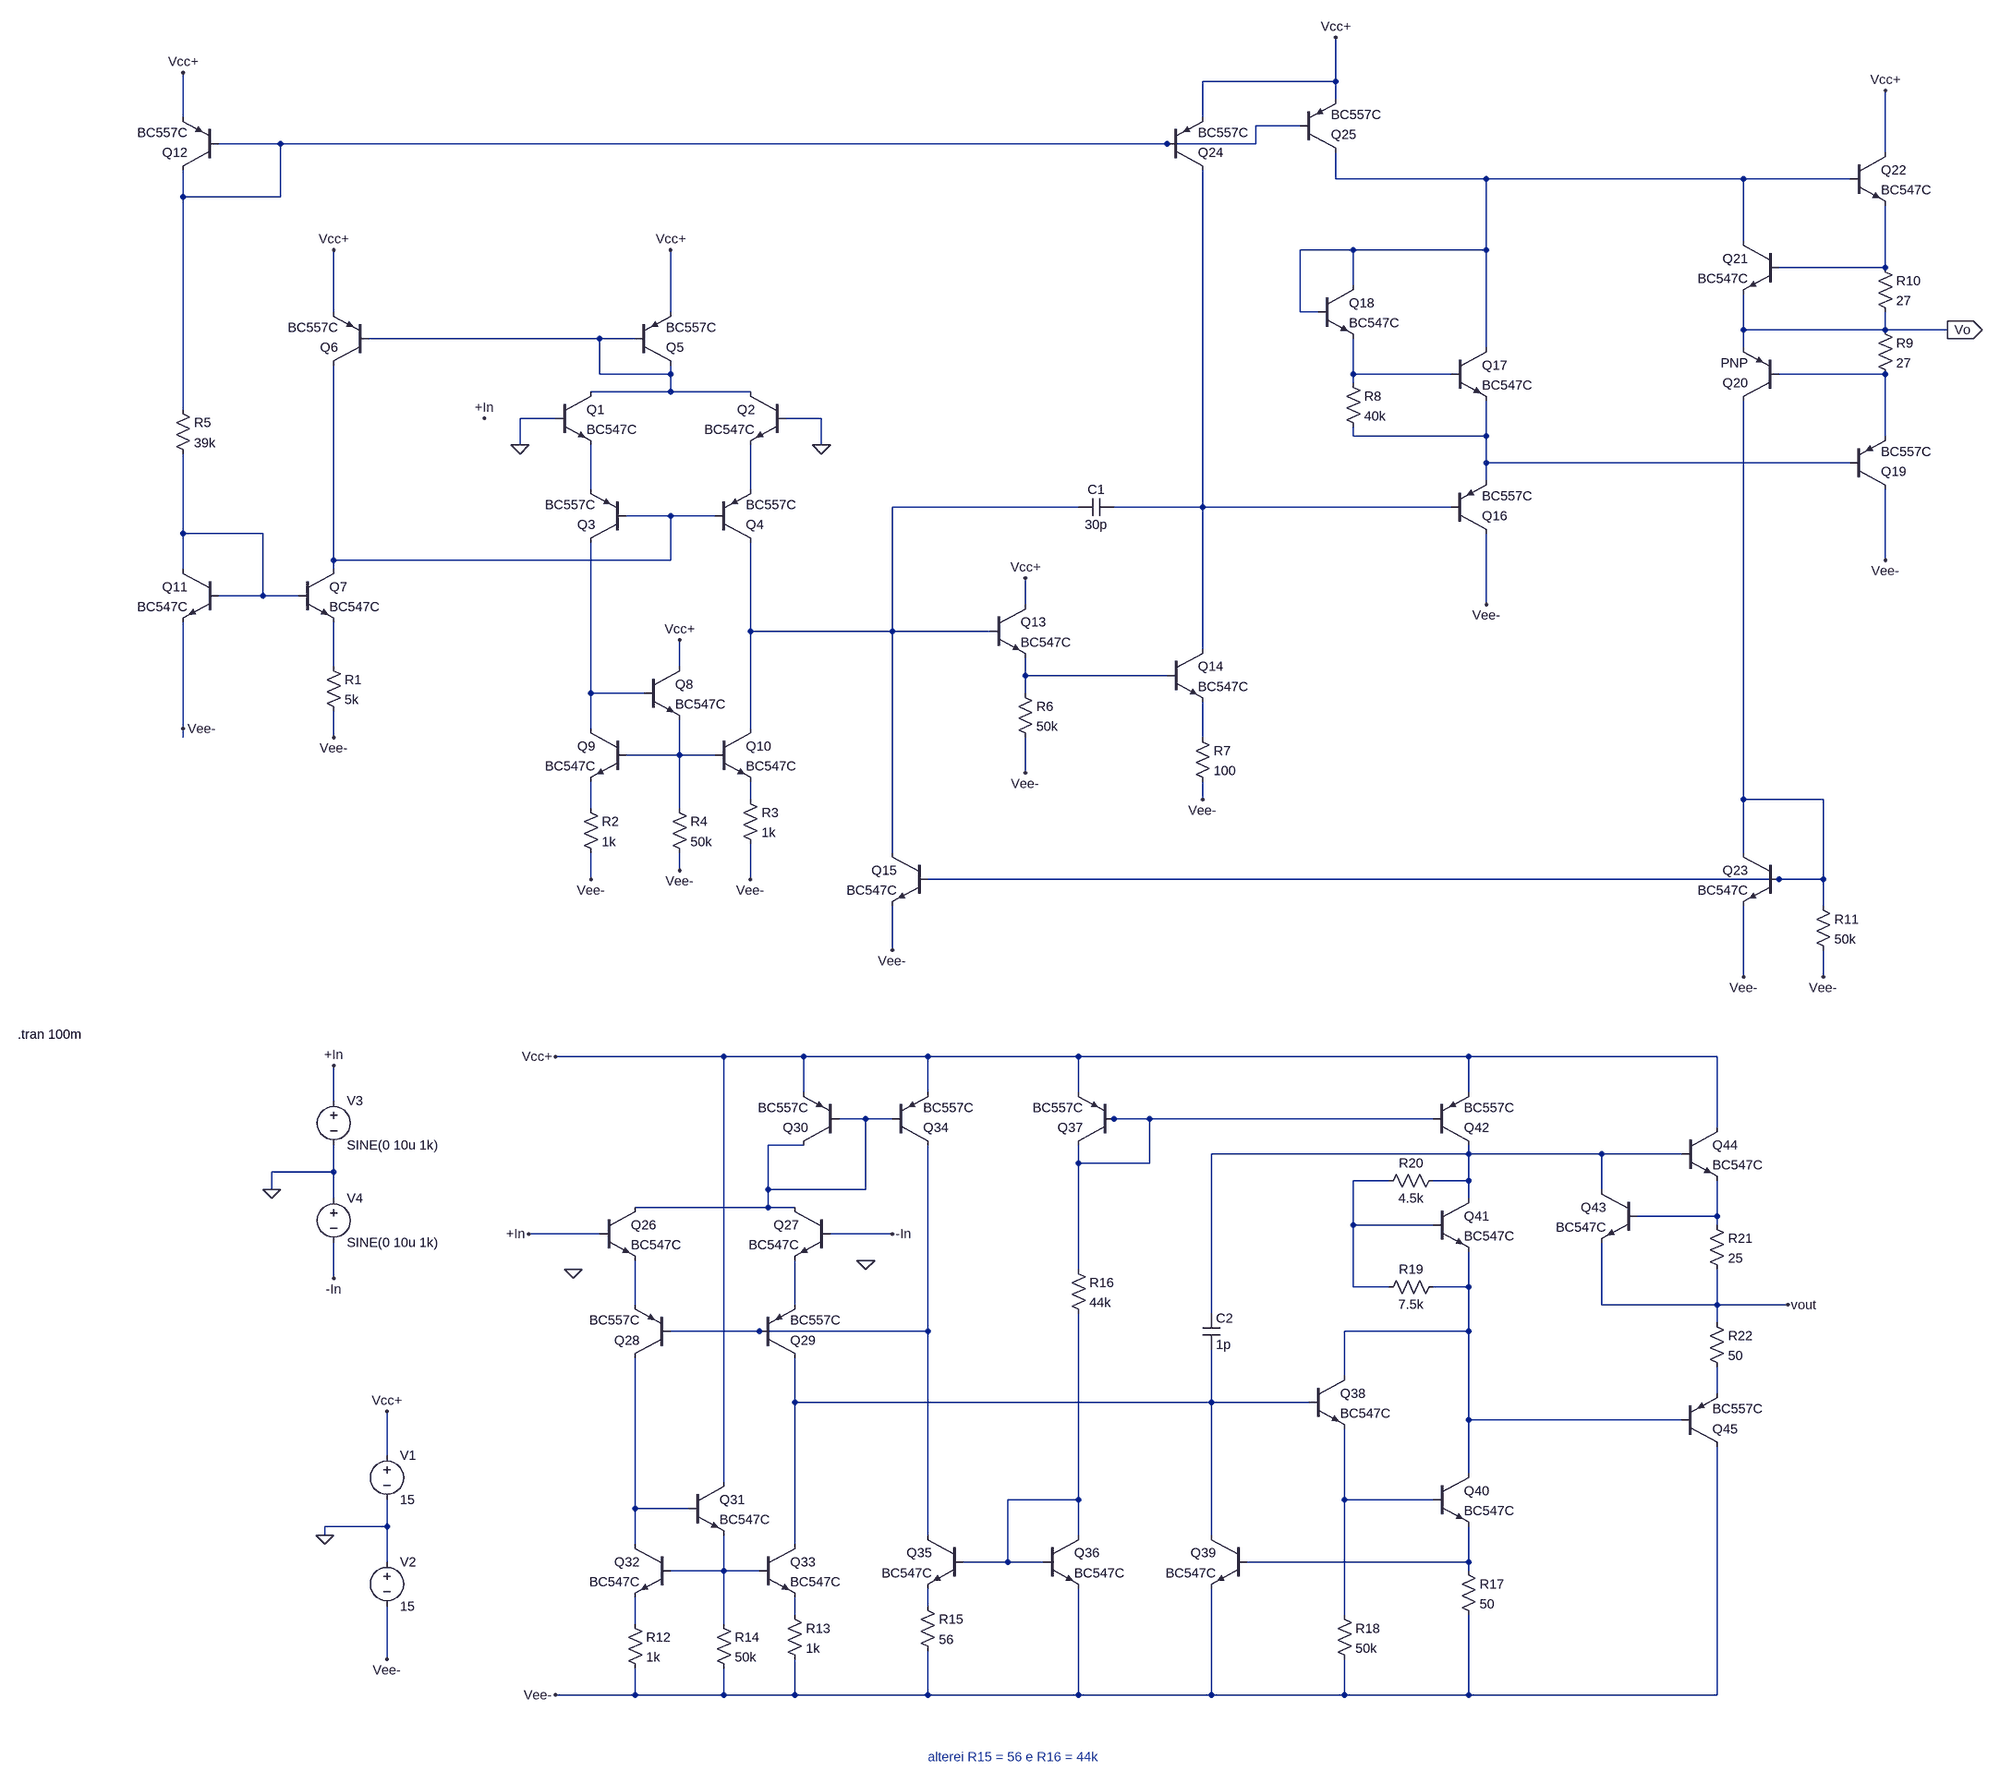
[diagram p0: schematic AmpOpDRIVE.asc]
AmpOpDRIVE.asc, the LTspice schematic file:
Version 4.1
SHEET 1 2760 2624
WIRE 1568 -480 1568 -560
WIRE 1568 -480 1328 -480
WIRE 1568 -448 1568 -480
WIRE -512 -416 -512 -496
WIRE 1328 -416 1328 -480
WIRE 1504 -400 1424 -400
WIRE -336 -368 -448 -368
WIRE 1264 -368 -336 -368
WIRE 1424 -368 1424 -400
WIRE 1424 -368 1264 -368
WIRE 2560 -352 2560 -464
WIRE 1568 -304 1568 -352
WIRE 1840 -304 1568 -304
WIRE 2304 -304 1840 -304
WIRE 2496 -304 2304 -304
WIRE -512 -272 -512 -320
WIRE -336 -272 -336 -368
WIRE -336 -272 -512 -272
WIRE 2304 -192 2304 -304
WIRE 1600 -176 1504 -176
WIRE 1840 -176 1840 -304
WIRE 1840 -176 1600 -176
WIRE 2560 -144 2560 -256
WIRE 2560 -144 2368 -144
WIRE 1600 -112 1600 -176
WIRE -240 -64 -240 -176
WIRE 368 -64 368 -176
WIRE 1504 -64 1504 -176
WIRE 1536 -64 1504 -64
WIRE 2304 -32 2304 -96
WIRE 2560 -32 2560 -64
WIRE 2560 -32 2304 -32
WIRE 2672 -32 2560 -32
WIRE 240 -16 -176 -16
WIRE 304 -16 240 -16
WIRE 1840 0 1840 -176
WIRE 2304 0 2304 -32
WIRE 240 48 240 -16
WIRE 368 48 368 32
WIRE 368 48 240 48
WIRE 1600 48 1600 -16
WIRE 1776 48 1600 48
WIRE 2560 48 2368 48
WIRE 1600 64 1600 48
WIRE 368 80 368 48
WIRE 368 80 224 80
WIRE 512 80 368 80
WIRE -512 112 -512 -272
WIRE 160 128 96 128
WIRE 640 128 576 128
WIRE 1600 160 1600 144
WIRE 1840 160 1840 96
WIRE 1840 160 1600 160
WIRE 2560 160 2560 48
WIRE 96 176 96 128
WIRE 640 176 640 128
WIRE 1840 208 1840 160
WIRE 2496 208 1840 208
WIRE 1840 240 1840 208
WIRE 224 256 224 176
WIRE 512 256 512 176
WIRE 1104 288 768 288
WIRE 1328 288 1328 -320
WIRE 1328 288 1168 288
WIRE 1776 288 1328 288
WIRE 368 304 288 304
WIRE 448 304 368 304
WIRE -512 336 -512 192
WIRE -368 336 -512 336
WIRE -240 384 -240 32
WIRE 368 384 368 304
WIRE 368 384 -240 384
WIRE 2560 384 2560 256
WIRE -512 400 -512 336
WIRE -240 400 -240 384
WIRE -368 448 -368 336
WIRE -368 448 -448 448
WIRE -304 448 -368 448
WIRE 1008 464 1008 416
WIRE 1840 464 1840 336
WIRE 512 512 512 352
WIRE 768 512 768 288
WIRE 768 512 512 512
WIRE 944 512 768 512
WIRE 1328 544 1328 288
WIRE -240 576 -240 496
WIRE 384 576 384 528
WIRE 1008 592 1008 560
WIRE 1264 592 1008 592
WIRE 224 624 224 352
WIRE 320 624 224 624
WIRE 1008 624 1008 592
WIRE -512 688 -512 496
WIRE 224 688 224 624
WIRE 512 688 512 512
WIRE -512 704 -512 688
WIRE -240 704 -240 656
WIRE 1328 704 1328 640
WIRE 384 736 384 672
WIRE 384 736 288 736
WIRE 448 736 384 736
WIRE 1008 768 1008 704
WIRE 512 816 512 784
WIRE 1328 816 1328 784
WIRE 2304 816 2304 96
WIRE 2448 816 2304 816
WIRE 224 832 224 784
WIRE 384 832 384 736
WIRE 768 912 768 512
WIRE 2304 912 2304 816
WIRE 384 944 384 912
WIRE 224 960 224 912
WIRE 512 960 512 896
WIRE 2368 960 832 960
WIRE 2448 960 2448 816
WIRE 2448 960 2368 960
WIRE 2448 1008 2448 960
WIRE 768 1088 768 1008
WIRE 2304 1136 2304 1008
WIRE 2448 1136 2448 1088
WIRE 464 1280 160 1280
WIRE 608 1280 464 1280
WIRE 832 1280 608 1280
WIRE 1104 1280 832 1280
WIRE 1808 1280 1104 1280
WIRE 2256 1280 1808 1280
WIRE 608 1344 608 1280
WIRE 832 1344 832 1280
WIRE 1104 1344 1104 1280
WIRE 1808 1344 1808 1280
WIRE -240 1360 -240 1296
WIRE 720 1392 672 1392
WIRE 768 1392 720 1392
WIRE 1168 1392 1152 1392
WIRE 1232 1392 1168 1392
WIRE 1744 1392 1232 1392
WIRE 2256 1408 2256 1280
WIRE 608 1440 544 1440
WIRE 1808 1456 1808 1440
WIRE 1808 1456 1344 1456
WIRE 2048 1456 1808 1456
WIRE 2192 1456 2048 1456
WIRE 1104 1472 1104 1440
WIRE 1232 1472 1232 1392
WIRE 1232 1472 1104 1472
WIRE -240 1488 -240 1440
WIRE -240 1488 -352 1488
WIRE 1664 1504 1600 1504
WIRE 1808 1504 1808 1456
WIRE 1808 1504 1744 1504
WIRE -352 1520 -352 1488
WIRE 544 1520 544 1440
WIRE 720 1520 720 1392
WIRE 720 1520 544 1520
WIRE 2048 1520 2048 1456
WIRE -240 1536 -240 1488
WIRE 1808 1536 1808 1504
WIRE 544 1552 544 1520
WIRE 544 1552 304 1552
WIRE 592 1552 544 1552
WIRE 2256 1568 2256 1504
WIRE 2256 1568 2112 1568
WIRE 1600 1584 1600 1504
WIRE 1744 1584 1600 1584
WIRE 2256 1584 2256 1568
WIRE 240 1600 112 1600
WIRE 768 1600 656 1600
WIRE 1104 1664 1104 1472
WIRE -240 1680 -240 1616
WIRE 1600 1696 1600 1584
WIRE 1664 1696 1600 1696
WIRE 1808 1696 1808 1632
WIRE 1808 1696 1744 1696
WIRE 304 1728 304 1648
WIRE 592 1728 592 1648
WIRE 2048 1728 2048 1616
WIRE 2256 1728 2256 1664
WIRE 2256 1728 2048 1728
WIRE 2384 1728 2256 1728
WIRE 1344 1744 1344 1456
WIRE 2256 1760 2256 1728
WIRE 528 1776 368 1776
WIRE 832 1776 832 1440
WIRE 832 1776 528 1776
WIRE 1808 1776 1808 1696
WIRE 1808 1776 1584 1776
WIRE 1584 1856 1584 1776
WIRE 2256 1888 2256 1840
WIRE 592 1904 592 1824
WIRE 1344 1904 1344 1808
WIRE 1344 1904 592 1904
WIRE 1520 1904 1344 1904
WIRE 1808 1936 1808 1776
WIRE 2192 1936 1808 1936
WIRE -144 2000 -144 1920
WIRE 1808 2032 1808 1936
WIRE 464 2048 464 1280
WIRE 1104 2080 1104 1744
WIRE 1104 2080 976 2080
WIRE 1584 2080 1584 1952
WIRE 1744 2080 1584 2080
WIRE 304 2096 304 1824
WIRE 400 2096 304 2096
WIRE -144 2128 -144 2080
WIRE -144 2128 -256 2128
WIRE -256 2144 -256 2128
WIRE 832 2144 832 1776
WIRE 1104 2144 1104 2080
WIRE 1344 2144 1344 1904
WIRE 304 2160 304 2096
WIRE 592 2160 592 1904
WIRE -144 2192 -144 2128
WIRE 976 2192 976 2080
WIRE 976 2192 896 2192
WIRE 1040 2192 976 2192
WIRE 1808 2192 1808 2128
WIRE 1808 2192 1408 2192
WIRE 464 2208 464 2144
WIRE 464 2208 368 2208
WIRE 528 2208 464 2208
WIRE 1808 2208 1808 2192
WIRE 832 2272 832 2240
WIRE 592 2288 592 2256
WIRE 1584 2288 1584 2080
WIRE 304 2304 304 2256
WIRE 464 2304 464 2208
WIRE -144 2368 -144 2272
WIRE 304 2432 304 2384
WIRE 304 2432 160 2432
WIRE 464 2432 464 2384
WIRE 464 2432 304 2432
WIRE 592 2432 592 2368
WIRE 592 2432 464 2432
WIRE 832 2432 832 2352
WIRE 832 2432 592 2432
WIRE 1104 2432 1104 2240
WIRE 1104 2432 832 2432
WIRE 1344 2432 1344 2240
WIRE 1344 2432 1104 2432
WIRE 1584 2432 1584 2368
WIRE 1584 2432 1344 2432
WIRE 1808 2432 1808 2288
WIRE 1808 2432 1584 2432
WIRE 2256 2432 2256 1984
WIRE 2256 2432 1808 2432
FLAG -512 -496 Vcc+
FLAG 1568 -560 Vcc+
FLAG 2560 -464 Vcc+
FLAG -512 688 Vee-
FLAG -240 704 Vee-
FLAG 224 960 Vee-
FLAG 384 944 Vee-
FLAG 512 960 Vee-
FLAG 768 1088 Vee-
FLAG 2304 1136 Vee-
FLAG 2448 1136 Vee-
FLAG 1328 816 Vee-
FLAG 1008 768 Vee-
FLAG 1840 464 Vee-
FLAG 2560 384 Vee-
FLAG -240 -176 Vcc+
FLAG 368 -176 Vcc+
FLAG 1008 416 Vcc+
FLAG 384 528 Vcc+
FLAG 2672 -32 Vo
IOPIN 2672 -32 Out
FLAG -256 2144 0
FLAG -144 1920 Vcc+
FLAG -144 2368 Vee-
FLAG -240 1296 +In
FLAG 32 128 +In
FLAG 96 176 0
FLAG 640 176 0
FLAG 112 1600 +In
FLAG 720 1648 0
FLAG 160 1280 Vcc+
FLAG 160 2432 Vee-
FLAG 2384 1728 vout
FLAG -352 1520 0
FLAG -240 1680 -In
FLAG 768 1600 -In
FLAG 192 1664 0
SYMBOL npn 160 80 R0
SYMATTR InstName Q1
SYMATTR Value BC547C
SYMBOL npn 576 80 M0
SYMATTR InstName Q2
SYMATTR Value BC547C
SYMBOL pnp 288 352 R180
SYMATTR InstName Q3
SYMATTR Value BC557C
SYMBOL pnp 448 352 M180
SYMATTR InstName Q4
SYMATTR Value BC557C
SYMBOL pnp 304 32 M180
SYMATTR InstName Q5
SYMATTR Value BC557C
SYMBOL pnp -176 32 R180
SYMATTR InstName Q6
SYMATTR Value BC557C
SYMBOL npn -304 400 R0
SYMATTR InstName Q7
SYMATTR Value BC547C
SYMBOL res -256 560 R0
SYMATTR InstName R1
SYMATTR Value 5k
SYMBOL npn 320 576 R0
SYMATTR InstName Q8
SYMATTR Value BC547C
SYMBOL npn 288 688 M0
SYMATTR InstName Q9
SYMATTR Value BC547C
SYMBOL npn 448 688 R0
SYMATTR InstName Q10
SYMATTR Value BC547C
SYMBOL res 208 816 R0
SYMATTR InstName R2
SYMATTR Value 1k
SYMBOL res 496 800 R0
SYMATTR InstName R3
SYMATTR Value 1k
SYMBOL res 368 816 R0
SYMATTR InstName R4
SYMATTR Value 50k
SYMBOL npn -448 400 M0
SYMATTR InstName Q11
SYMATTR Value BC547C
SYMBOL res -528 96 R0
SYMATTR InstName R5
SYMATTR Value 39k
SYMBOL pnp -448 -320 R180
SYMATTR InstName Q12
SYMATTR Value BC557C
SYMBOL npn 944 464 R0
SYMATTR InstName Q13
SYMATTR Value BC547C
SYMBOL res 992 608 R0
SYMATTR InstName R6
SYMATTR Value 50k
SYMBOL npn 1264 544 R0
SYMATTR InstName Q14
SYMATTR Value BC547C
SYMBOL res 1312 688 R0
SYMATTR InstName R7
SYMATTR Value 100
SYMBOL cap 1168 272 R90
WINDOW 0 0 32 VBottom 2
WINDOW 3 32 32 VTop 2
SYMATTR InstName C1
SYMATTR Value 30p
SYMBOL npn 832 912 M0
SYMATTR InstName Q15
SYMATTR Value BC547C
SYMBOL pnp 1776 336 M180
SYMATTR InstName Q16
SYMATTR Value BC557C
SYMBOL npn 1776 0 R0
SYMATTR InstName Q17
SYMATTR Value BC547C
SYMBOL npn 1536 -112 R0
SYMATTR InstName Q18
SYMATTR Value BC547C
SYMBOL res 1584 48 R0
SYMATTR InstName R8
SYMATTR Value 40k
SYMBOL pnp 2496 256 M180
SYMATTR InstName Q19
SYMATTR Value BC557C
SYMBOL pnp 2368 96 R180
SYMATTR InstName Q20
SYMBOL res 2544 -48 R0
SYMATTR InstName R9
SYMATTR Value 27
SYMBOL npn 2368 -192 M0
SYMATTR InstName Q21
SYMATTR Value BC547C
SYMBOL res 2544 -160 R0
SYMATTR InstName R10
SYMATTR Value 27
SYMBOL npn 2496 -352 R0
SYMATTR InstName Q22
SYMATTR Value BC547C
SYMBOL npn 2368 912 M0
SYMATTR InstName Q23
SYMATTR Value BC547C
SYMBOL res 2432 992 R0
SYMATTR InstName R11
SYMATTR Value 50k
SYMBOL pnp 1264 -320 M180
SYMATTR InstName Q24
SYMATTR Value BC557C
SYMBOL pnp 1504 -352 M180
SYMATTR InstName Q25
SYMATTR Value BC557C
SYMBOL voltage -144 1984 R0
WINDOW 123 0 0 Left 0
WINDOW 39 0 0 Left 0
SYMATTR InstName V1
SYMATTR Value 15
SYMBOL voltage -144 2176 R0
WINDOW 123 0 0 Left 0
WINDOW 39 0 0 Left 0
SYMATTR InstName V2
SYMATTR Value 15
SYMBOL voltage -240 1344 R0
WINDOW 123 0 0 Left 0
WINDOW 39 0 0 Left 0
SYMATTR InstName V3
SYMATTR Value SINE(0 10u 1k)
SYMBOL npn 240 1552 R0
SYMATTR InstName Q26
SYMATTR Value BC547C
SYMBOL npn 656 1552 M0
SYMATTR InstName Q27
SYMATTR Value BC547C
SYMBOL pnp 368 1824 R180
SYMATTR InstName Q28
SYMATTR Value BC557C
SYMBOL pnp 528 1824 M180
SYMATTR InstName Q29
SYMATTR Value BC557C
SYMBOL npn 400 2048 R0
SYMATTR InstName Q31
SYMATTR Value BC547C
SYMBOL npn 368 2160 M0
SYMATTR InstName Q32
SYMATTR Value BC547C
SYMBOL npn 528 2160 R0
SYMATTR InstName Q33
SYMATTR Value BC547C
SYMBOL res 288 2288 R0
SYMATTR InstName R12
SYMATTR Value 1k
SYMBOL res 576 2272 R0
SYMATTR InstName R13
SYMATTR Value 1k
SYMBOL res 448 2288 R0
SYMATTR InstName R14
SYMATTR Value 50k
SYMBOL pnp 672 1440 R180
SYMATTR InstName Q30
SYMATTR Value BC557C
SYMBOL pnp 768 1440 M180
SYMATTR InstName Q34
SYMATTR Value BC557C
SYMBOL npn 896 2144 M0
SYMATTR InstName Q35
SYMATTR Value BC547C
SYMBOL res 816 2256 R0
SYMATTR InstName R15
SYMATTR Value 56
SYMBOL npn 1040 2144 R0
SYMATTR InstName Q36
SYMATTR Value BC547C
SYMBOL res 1088 1648 R0
SYMATTR InstName R16
SYMATTR Value 44k
SYMBOL pnp 1168 1440 R180
SYMATTR InstName Q37
SYMATTR Value BC557C
SYMBOL npn 1520 1856 R0
SYMATTR InstName Q38
SYMATTR Value BC547C
SYMBOL npn 1408 2144 M0
SYMATTR InstName Q39
SYMATTR Value BC547C
SYMBOL cap 1328 1744 R0
SYMATTR InstName C2
SYMATTR Value 1p
SYMBOL npn 1744 2032 R0
SYMATTR InstName Q40
SYMATTR Value BC547C
SYMBOL res 1792 2192 R0
SYMATTR InstName R17
SYMATTR Value 50
SYMBOL res 1568 2272 R0
SYMATTR InstName R18
SYMATTR Value 50k
SYMBOL npn 1744 1536 R0
SYMATTR InstName Q41
SYMATTR Value BC547C
SYMBOL res 1760 1680 R90
WINDOW 0 0 56 VBottom 2
WINDOW 3 32 56 VTop 2
SYMATTR InstName R19
SYMATTR Value 7.5k
SYMBOL pnp 1744 1440 M180
SYMATTR InstName Q42
SYMATTR Value BC557C
SYMBOL res 1760 1488 R90
WINDOW 0 0 56 VBottom 2
WINDOW 3 32 56 VTop 2
SYMATTR InstName R20
SYMATTR Value 4.5k
SYMBOL npn 2192 1408 R0
SYMATTR InstName Q44
SYMATTR Value BC547C
SYMBOL res 2240 1568 R0
SYMATTR InstName R21
SYMATTR Value 25
SYMBOL res 2240 1744 R0
SYMATTR InstName R22
SYMATTR Value 50
SYMBOL npn 2112 1520 M0
SYMATTR InstName Q43
SYMATTR Value BC547C
SYMBOL pnp 2192 1984 M180
SYMATTR InstName Q45
SYMATTR Value BC557C
SYMBOL voltage -240 1520 R0
WINDOW 123 0 0 Left 0
WINDOW 39 0 0 Left 0
SYMATTR InstName V4
SYMATTR Value SINE(0 10u 1k)
TEXT -1032 1240 Left 2 !.tran 100m
TEXT 832 2544 Left 2 ;alterei R15 = 56 e R16 = 44k

The netlist it stands for:
* AmpOpDRIVE.asc
Q1 N004 0 N008 0 BC547C
Q2 N004 0 N009 0 BC547C
Q3 N016 N012 N008 0 BC557C
Q4 N010 N012 N009 0 BC557C
Q5 N004 N004 Vcc+ 0 BC557C
Q6 N012 N004 Vcc+ 0 BC557C
Q7 N012 N013 N014 0 BC547C
R1 N014 Vee- 5k
Q8 Vcc+ N016 N018 0 BC547C
Q9 N016 N018 N021 0 BC547C
Q10 N010 N018 N019 0 BC547C
R2 N021 Vee- 1k
R3 N019 Vee- 1k
R4 N018 Vee- 50k
Q11 N013 N013 Vee- 0 BC547C
R5 N001 N013 39k
Q12 N001 N001 Vcc+ 0 BC557C
Q13 Vcc+ N010 N015 0 BC547C
R6 N015 Vee- 50k
Q14 N011 N015 N017 0 BC547C
R7 N017 Vee- 100
C1 N011 N010 30p
Q15 N010 N020 Vee- 0 BC547C
Q16 Vee- N011 N007 0 BC557C
Q17 N002 N005 N007 0 BC547C
Q18 N002 N002 N005 0 BC547C
R8 N005 N007 40k
Q19 Vee- N007 N006 0 BC557C
Q20 N020 N006 Vo 0 PNP
R9 Vo N006 27
Q21 N002 N003 Vo 0 BC547C
R10 N003 Vo 27
Q22 Vcc+ N002 N003 0 BC547C
Q23 N020 N020 Vee- 0 BC547C
R11 N020 Vee- 50k
Q24 N011 N001 Vcc+ 0 BC557C
Q25 N002 N001 Vcc+ 0 BC557C
V1 Vcc+ 0 15
V2 0 Vee- 15
V3 +In 0 SINE(0 10u 1k)
Q26 N022 +In N028 0 BC547C
Q27 N022 -In N029 0 BC547C
Q28 N035 N030 N028 0 BC557C
Q29 N032 N030 N029 0 BC557C
Q31 Vcc+ N035 N037 0 BC547C
Q32 N035 N037 N040 0 BC547C
Q33 N032 N037 N039 0 BC547C
R12 N040 Vee- 1k
R13 N039 Vee- 1k
R14 N037 Vee- 50k
Q30 N022 N022 Vcc+ 0 BC557C
Q34 N030 N022 Vcc+ 0 BC557C
Q35 N030 N033 N038 0 BC547C
R15 N038 Vee- 56
Q36 N033 N033 Vee- 0 BC547C
R16 N023 N033 44k
Q37 N023 N023 Vcc+ 0 BC557C
Q38 N027 N032 N034 0 BC547C
Q39 N032 N036 Vee- 0 BC547C
C2 N024 N032 1p
Q40 N027 N034 N036 0 BC547C
R17 N036 Vee- 50
R18 N034 Vee- 50k
Q41 N024 N025 N027 0 BC547C
R19 N027 N025 7.5k
Q42 N024 N023 Vcc+ 0 BC557C
R20 N024 N025 4.5k
Q44 Vcc+ N024 N026 0 BC547C
R21 N026 vout 25
R22 vout N031 50
Q43 N024 N026 vout 0 BC547C
Q45 Vee- N027 N031 0 BC557C
V4 0 -In SINE(0 10u 1k)
.model NPN NPN
.model PNP PNP
.lib standard.bjt
.tran 100m
* alterei R15 = 56 e R16 = 44k
.backanno
.end